# EAGLE schematic minimal-arduino-uno-rev3-02-th (EAGLE 9.2.2)
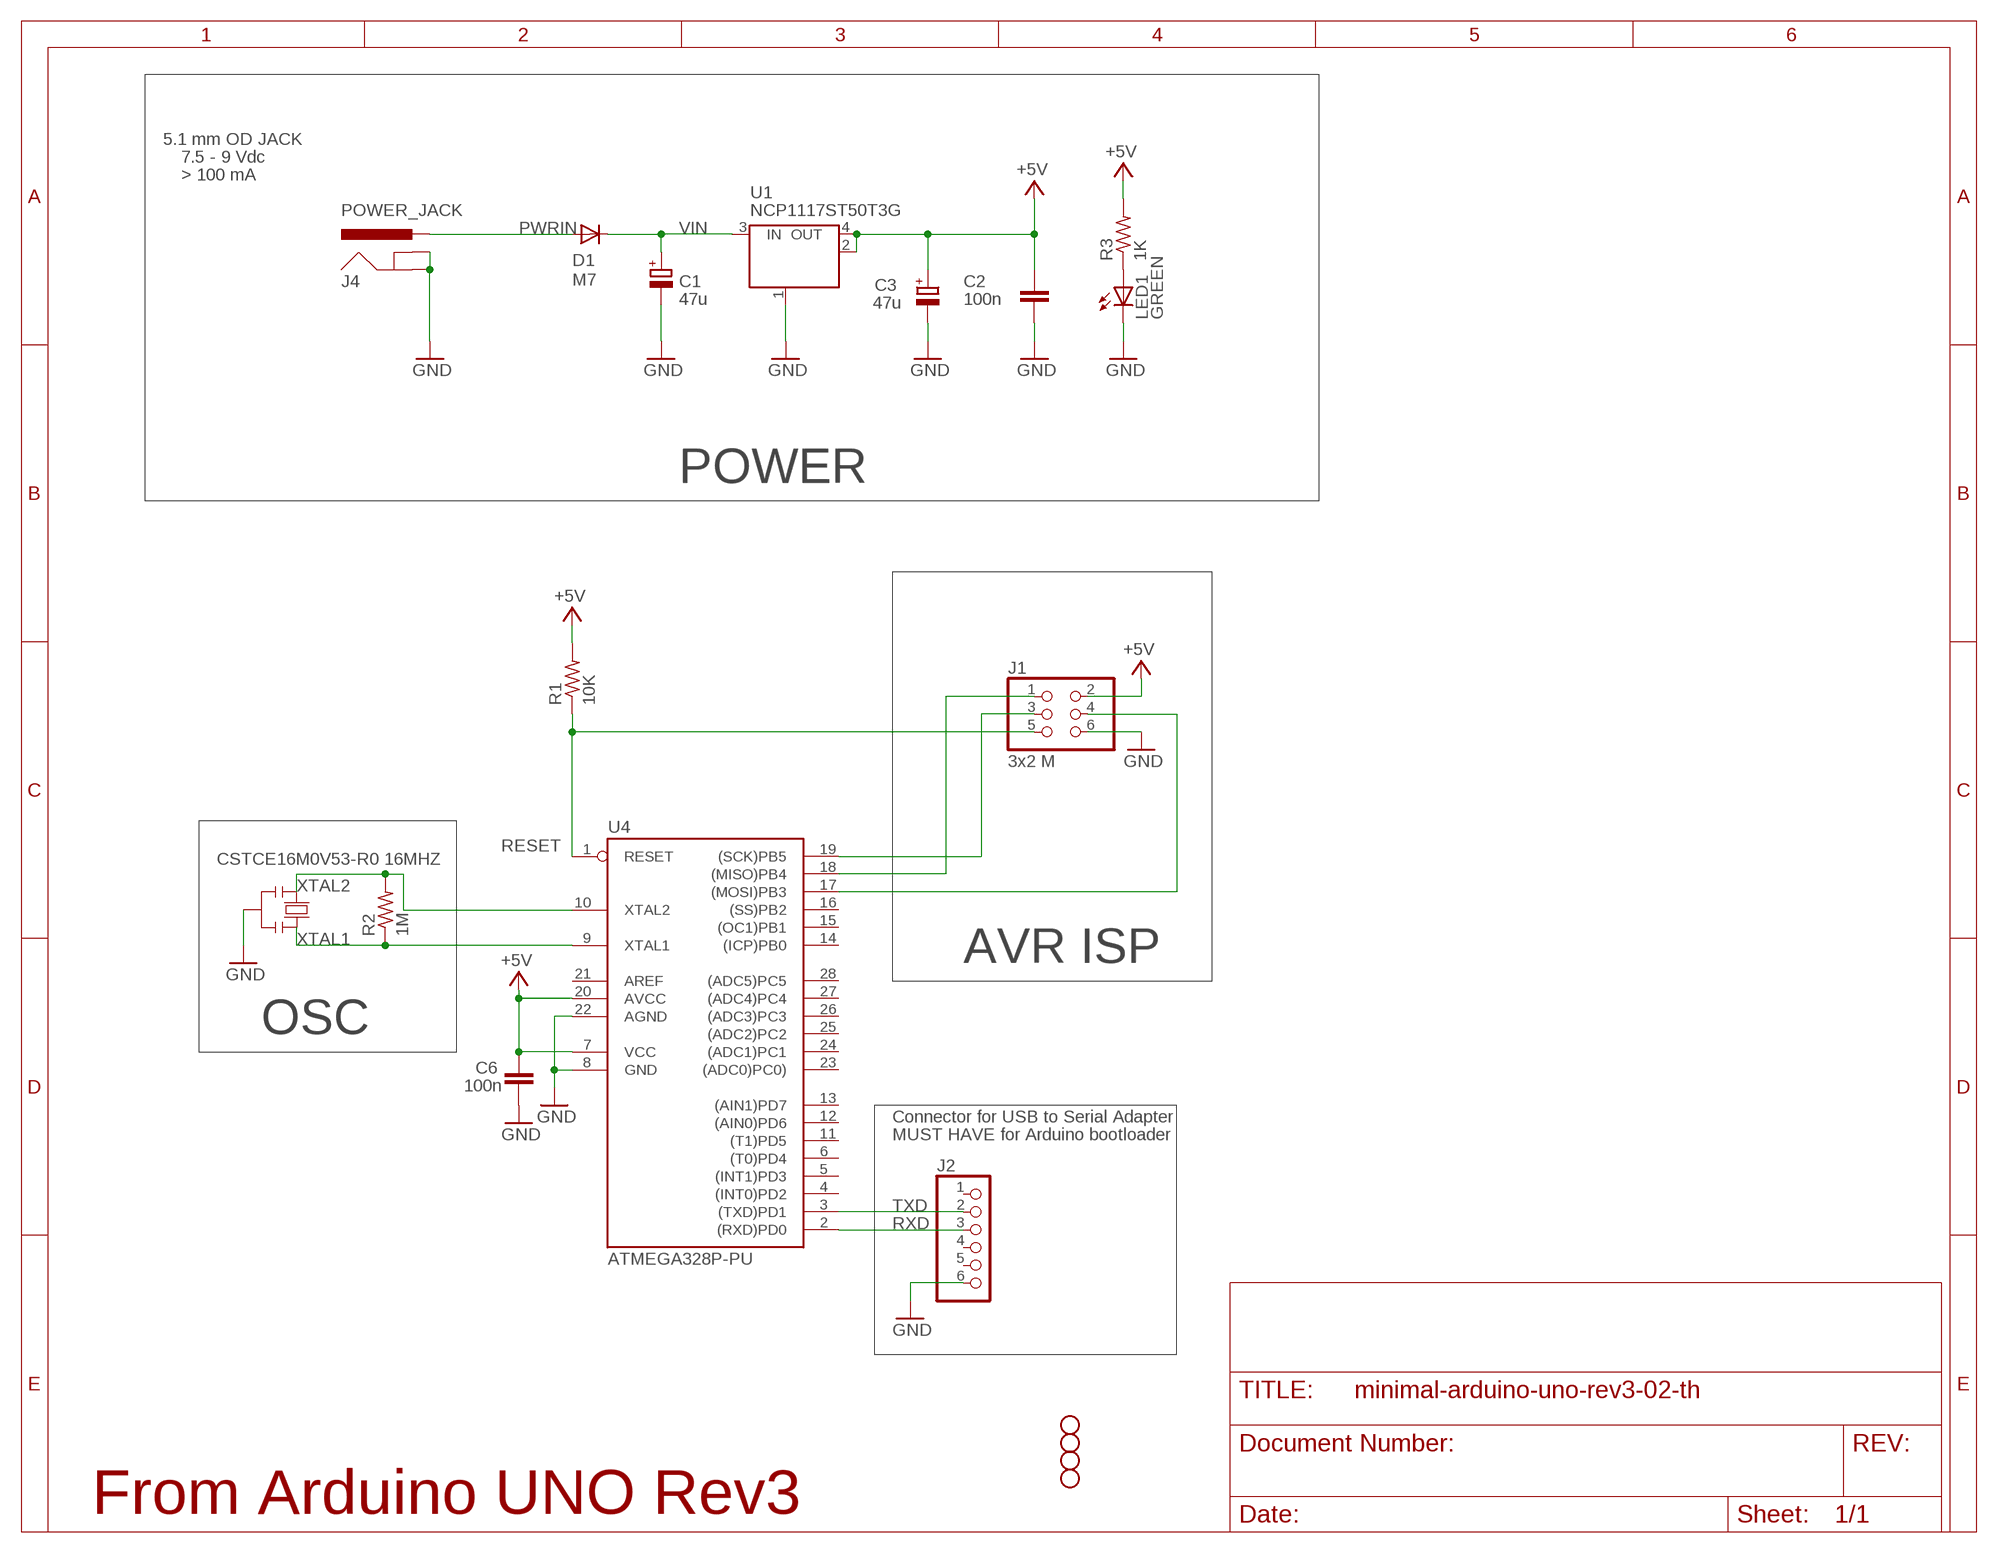
[diagram p0: schematic, sheet 1]

## Parts
C1  47u  CPOL-EUD  [PANASONIC_D]
C2  100n  C-EUC0805  [C0805]
C3  47u  CPOL-EUD  [PANASONIC_D]
C6  100n  C-EUC0805  [C0805]
D1  M7  DIODE-SMB  [SMB]
H1  STAND-OFF  [STAND-OFF]
H2  STAND-OFF  [STAND-OFF]
H3  STAND-OFF  [STAND-OFF]
H4  STAND-OFF  [STAND-OFF]
J1  3x2 M  PINHD-2X3  [2X03]
J2  PINHD-1X6  [1X06]
J4  POWER_JACK  [POWER_JACK_PTH]
LED1  GREEN  LEDCHIP-LED0805  [CHIP-LED0805]
R1  10K  R-US_R0805  [R0805]
R2  1M  R-US_R0805  [R0805]
R3  1K  R-US_R0805  [R0805]
U1  NCP1117ST50T3G  MC33269ST-3.3T3  [SOT223]
U4  ATMEGA328P-PU  [DIL28-3]
X1  CSTCE16M0V53-R0 16MHZ  RESONATORMU  [RESONATOR]

## Nets
+5V [usbvcc]: C2.2 C3.+ C6.2 J1.2 R1.2 R3.2 U1.2(OUT) U1.4(OUT) U4.7(VCC) U4.20(AVCC)
GND [gnd]: C1.- C2.1 C3.- C6.1 J1.6 J2.6 J4.GND J4.GNDBREAK LED1.C U1.1(GND/ADJ) U4.8(GND) U4.22(AGND) X1.2
MISO: J1.1 U4.18((MISO)PB4)
MOSI: J1.4 U4.17((MOSI)PB3)
N$3: LED1.A R3.1
PWRIN [power]: D1.A J4.PWR
RESET: J1.5 R1.1 U4.1(RESET)
RXD: J2.3 U4.2((RXD)PD0)
SCK: J1.3 U4.19((SCK)PB5)
TXD: J2.2 U4.3((TXD)PD1)
VIN [power]: C1.+ D1.C U1.3(IN)
XTAL1: R2.1 U4.9(XTAL1) X1.3
XTAL2: R2.2 U4.10(XTAL2) X1.1
Unconnected: J2.1 J2.4 J2.5 U4.4((INT0)PD2) U4.5((INT1)PD3) U4.6((T0)PD4) U4.11((T1)PD5) U4.12((AIN0)PD6) U4.13((AIN1)PD7) U4.14((ICP)PB0) U4.15((OC1)PB1) U4.16((SS)PB2) U4.21(AREF) U4.23((ADC0)PC0)) U4.24((ADC1)PC1) U4.25((ADC2)PC2) U4.26((ADC3)PC3) U4.27((ADC4)PC4) U4.28((ADC5)PC5)

## Notes on the sheet
- 5.1 mm OD JACK
- 7.5 - 9 Vdc
- > 100 mA
- POWER
- AVR ISP
- OSC
- Connector for USB to Serial Adapter
- MUST HAVE for Arduino bootloader
- From Arduino UNO Rev3

## Library data of the parts
C1 C3 = rcl:CPOL-EU: POLARIZED CAPACITOR, European symbol
C2 C6 = rcl:C-EU: CAPACITOR, European symbol
D1 = diode:DIODE-: DIODE
H1-H4 = SparkFun-Hardware:STAND-OFF: Stand Off Drill holes for mechanically mounting via screws, standoffs, etc. Note: Use the keepout ring to avoid running the screw head into surrounding components. Variant Overviews STAND-OFF - Mechanical footprint for a #4 phillips button head screw. STAND-OFF-TIGHT - Mechanical footprint for a #4 phillips button head screw, Example SparkFun Products Screw - Phillips Head (1/4", 4-40, 10 pack) <https://www.sparkfun.com/products/10453> (PRT-10453) Screw - Phillips Head (1/2", 4-40, 10 pack) <https://www.sparkfun.com/products/10452> (PRT-10452) Screw - Phillips Head (3/4", 4-40, 10 pack) <https://www.sparkfun.com/products/10451> (PRT-10451) Screw - Phillips Head (1", 4-40, 10 pack) <https://www.sparkfun.com/products/10450> (PRT-10450)
J1 = SmartPrj:PINHD-2X3: PIN HEADER
J2 = pinhead:PINHD-1X6: PIN HEADER
J4 = SparkFun-Connectors:POWER_JACK: Power Jack Connector This is the standard 5.5mm barrel jack for power. The PTH is the most common, proven, reliable, footprint. The Slot footprint only works if the mill layer is transmitted to the PCB fab house so be warned. Here are the connectors we sell at SparkFun: DC Barrel Power Jack/Connector <https://www.sparkfun.com/products/119> (PRT-00119) DC Barrel Power Jack/Connector (SMD) <https://www.sparkfun.com/products/12748> (PRT-12748) DC Barrel Jack Adapter - Breadboard Compatible <https://www.sparkfun.com/products/10811> (PRT-10811) It is used on this SparkFun product (and many, many others): SparkFun RedBoard - Programmed with Arduino <https://www.sparkfun.com/products/12757> (DEV-12757) Also, if you need a mating power supply or connector, please check these out: Wall Adapter Power Supply - 9VDC 650mA <https://www.sparkfun.com/products/298> (TOL-00298) DC Barrel Jack Adapter - Male <https://www.sparkfun.com/products/10287> (PRT-10287); PROD_ID: CONN-08197
LED1 = led:LED: LED OSRAM: - CHIPLED LG R971, LG N971, LY N971, LG Q971, LY Q971, LO R971, LY R971 LH N974, LH R974 LS Q976, LO Q976, LY Q976 LO Q996 - Hyper CHIPLED LW Q18S LB Q993, LB Q99A, LB R99A - SideLED LS A670, LO A670, LY A670, LG A670, LP A670 LB A673, LV A673, LT A673, LW A673 LH A674 LY A675 LS A676, LA A676, LO A676, LY A676, LW A676 LS A679, LY A679, LG A679 - Hyper Micro SIDELED® LS Y876, LA Y876, LO Y876, LY Y876 LT Y87S - SmartLED LW L88C, LW L88S LB L89C, LB L89S, LG L890 LS L89K, LO L89K, LY L89K LS L896, LA L896, LO L896, LY L896 - TOPLED LS T670, LO T670, LY T670, LG T670, LP T670 LSG T670, LSP T670, LSY T670, LOP T670, LYG T670 LG T671, LOG T671, LSG T671 LB T673, LV T673, LT T673, LW T673 LH T674 LS T676, LA T676, LO T676, LY T676, LB T676, LH T676, LSB T676, LW T676 LB T67C, LV T67C, LT T67C, LS T67K, LO T67K, LY T67K, LW E67C LS E67B, LA E67B, LO E67B, LY E67B, LB E67C, LV E67C, LT E67C LW T67C LS T679, LY T679, LG T679 LS T770, LO T770, LY T770, LG T770, LP T770 LB T773, LV T773, LT T773, LW T773 LH T774 LS E675, LA E675, LY E675, LS T675 LS T776, LA T776, LO T776, LY T776, LB T776 LHGB T686 LT T68C, LB T68C - Hyper Mini TOPLED® LB M676 - Mini TOPLED Santana® LG M470 LS M47K, LO M47K, LY M47K Source: http://www.osram.convergy.de LUXEON: - LUMILED® LXK2-PW12-R00, LXK2-PW12-S00, LXK2-PW14-U00, LXK2-PW14-V00 LXK2-PM12-R00, LXK2-PM12-S00, LXK2-PM14-U00 LXK2-PE12-Q00, LXK2-PE12-R00, LXK2-PE12-S00, LXK2-PE14-T00, LXK2-PE14-U00 LXK2-PB12-K00, LXK2-PB12-L00, LXK2-PB12-M00, LXK2-PB14-N00, LXK2-PB14-P00, LXK2-PB14-Q00 LXK2-PR12-L00, LXK2-PR12-M00, LXK2-PR14-Q00, LXK2-PR14-R00 LXK2-PD12-Q00, LXK2-PD12-R00, LXK2-PD12-S00 LXK2-PH12-R00, LXK2-PH12-S00 LXK2-PL12-P00, LXK2-PL12-Q00, LXK2-PL12-R00 Source: www.luxeon.com KINGBRIGHT: KA-3528ASYC Source: www.kingbright.com
R1-R3 = rcl:R-US_: RESISTOR, American symbol
U1 = linear:MC33269ST*: Adjustable Output Low Dropout Voltage Regulator 800 mA Source: http://www.onsemi.com/pub/Collateral/MC33269-D.PDF
U4 = SmartPrj:ATMEGA328P-: MICROCONTROLLER 4 Kbytes FLASH 128 bytes SRAM 256 bytes EEPROM UART 6-channel 10 bit ADC
X1 = SmartPrj:RESONATOR

## Net classes
0 default: width 0.254 mm, clearance 0.254 mm
1 power: width 0.61 mm, drill 0.61 mm, clearance 0.254 mm
2 gnd: width 0.305 mm, drill 0.559 mm, clearance 0.254 mm
3 usbvcc: width 0.508 mm, drill 0.61 mm, clearance 0.254 mm
4 aref: width 0.406 mm, drill 0.61 mm, clearance 0.254 mm